# EAGLE design Dreamcast (EAGLE 9.6.2)
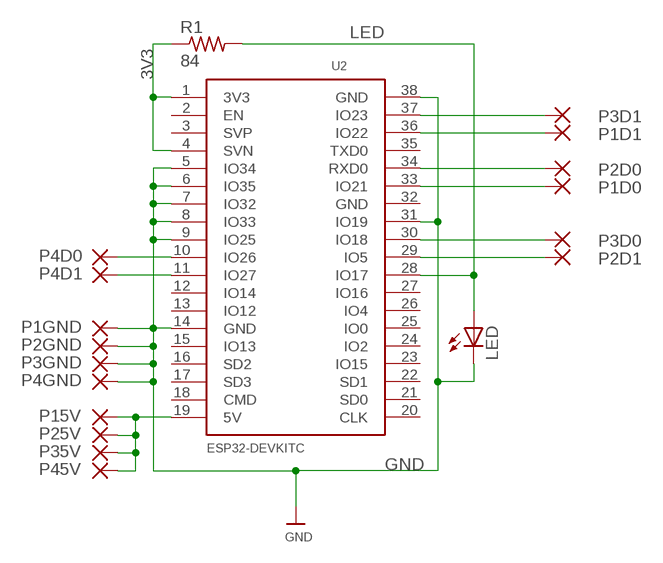
[diagram p0: schematic, sheet 1]

## Parts
LED  LEDCHIPLED_1206  [CHIPLED_1206]
P1D0  SMD5  [SMD2,54-5,08]
P1D1  SMD5  [SMD2,54-5,08]
P1GND  SMD5  [SMD2,54-5,08]
P2D0  SMD5  [SMD2,54-5,08]
P2D1  SMD5  [SMD2,54-5,08]
P2GND  SMD5  [SMD2,54-5,08]
P3D0  SMD5  [SMD2,54-5,08]
P3D1  SMD5  [SMD2,54-5,08]
P3GND  SMD5  [SMD2,54-5,08]
P4D0  SMD5  [SMD2,54-5,08]
P4D1  SMD5  [SMD2,54-5,08]
P4GND  SMD5  [SMD2,54-5,08]
P15V  SMD5  [SMD2,54-5,08]
P25V  SMD5  [SMD2,54-5,08]
P35V  SMD5  [SMD2,54-5,08]
P45V  SMD5  [SMD2,54-5,08]
R1  84  R-US_R1206  [R1206]
U2  ESP32DEVKITC  [ESP32-DEVKITC]

## Nets
3V3: R1.1 U2.1(3V3) U2.4(SVN)
5V: P15V.1(P) P25V.1(P) P35V.1(P) P45V.1(P) U2.19(5V)
GND: LED.C P1GND.1(P) P2GND.1(P) P3GND.1(P) P4GND.1(P) U2.5(IO34) U2.6(IO35) U2.7(IO32) U2.8(IO33) U2.9(IO25) U2.14(GND) U2.31(IO19) U2.38(GND)
LED: LED.A R1.2 U2.28(IO17)
P1D0: P1D0.1(P) U2.33(IO21)
P1D1: P1D1.1(P) U2.36(IO22)
P2D0: P2D0.1(P) U2.34(RXD0)
P2D1: P2D1.1(P) U2.29(IO5)
P3D0: P3D0.1(P) U2.30(IO18)
P3D1: P3D1.1(P) U2.37(IO23)
P4D0: P4D0.1(P) U2.10(IO26)
P4D1: P4D1.1(P) U2.11(IO27)
Unconnected: U2.2(EN) U2.3(SVP) U2.12(IO14) U2.13(IO12) U2.15(IO13) U2.16(SD2) U2.17(SD3) U2.18(CMD) U2.20(CLK) U2.21(SD0) U2.22(SD1) U2.23(IO15) U2.24(IO2) U2.25(IO0) U2.26(IO4) U2.27(IO16) U2.32(GND) U2.35(TXD0)

## Library data of the parts
LED = adafruit:LED: LED OSRAM: - CHIPLED LG R971, LG N971, LY N971, LG Q971, LY Q971, LO R971, LY R971 LH N974, LH R974 LS Q976, LO Q976, LY Q976 LO Q996 - Hyper CHIPLED LW Q18S LB Q993, LB Q99A, LB R99A - SideLED LS A670, LO A670, LY A670, LG A670, LP A670 LB A673, LV A673, LT A673, LW A673 LH A674 LY A675 LS A676, LA A676, LO A676, LY A676, LW A676 LS A679, LY A679, LG A679 - Hyper Micro SIDELED® LS Y876, LA Y876, LO Y876, LY Y876 LT Y87S - SmartLED LW L88C, LW L88S LB L89C, LB L89S, LG L890 LS L89K, LO L89K, LY L89K LS L896, LA L896, LO L896, LY L896 - TOPLED LS T670, LO T670, LY T670, LG T670, LP T670 LSG T670, LSP T670, LSY T670, LOP T670, LYG T670 LG T671, LOG T671, LSG T671 LB T673, LV T673, LT T673, LW T673 LH T674 LS T676, LA T676, LO T676, LY T676, LB T676, LH T676, LSB T676, LW T676 LB T67C, LV T67C, LT T67C, LS T67K, LO T67K, LY T67K, LW E67C LS E67B, LA E67B, LO E67B, LY E67B, LB E67C, LV E67C, LT E67C LW T67C LS T679, LY T679, LG T679 LS T770, LO T770, LY T770, LG T770, LP T770 LB T773, LV T773, LT T773, LW T773 LH T774 LS E675, LA E675, LY E675, LS T675 LS T776, LA T776, LO T776, LY T776, LB T776 LHGB T686 LT T68C, LB T68C - Hyper Mini TOPLED® LB M676 - Mini TOPLED Santana® LG M470 LS M47K, LO M47K, LY M47K Source: http://www.osram.convergy.de/
P1D0 P1D1 P1GND P2D0 P2D1 P2GND P3D0 P3D1 P3GND P4D0 P4D1 P4GND P15V P25V P35V P45V = wirepad:SMD5: SMD PAD
R1 = adafruit:R-US_: RESISTOR, American symbol
U2 = ESP32-DEVKITC4:ESP32DEVKITC

## Board
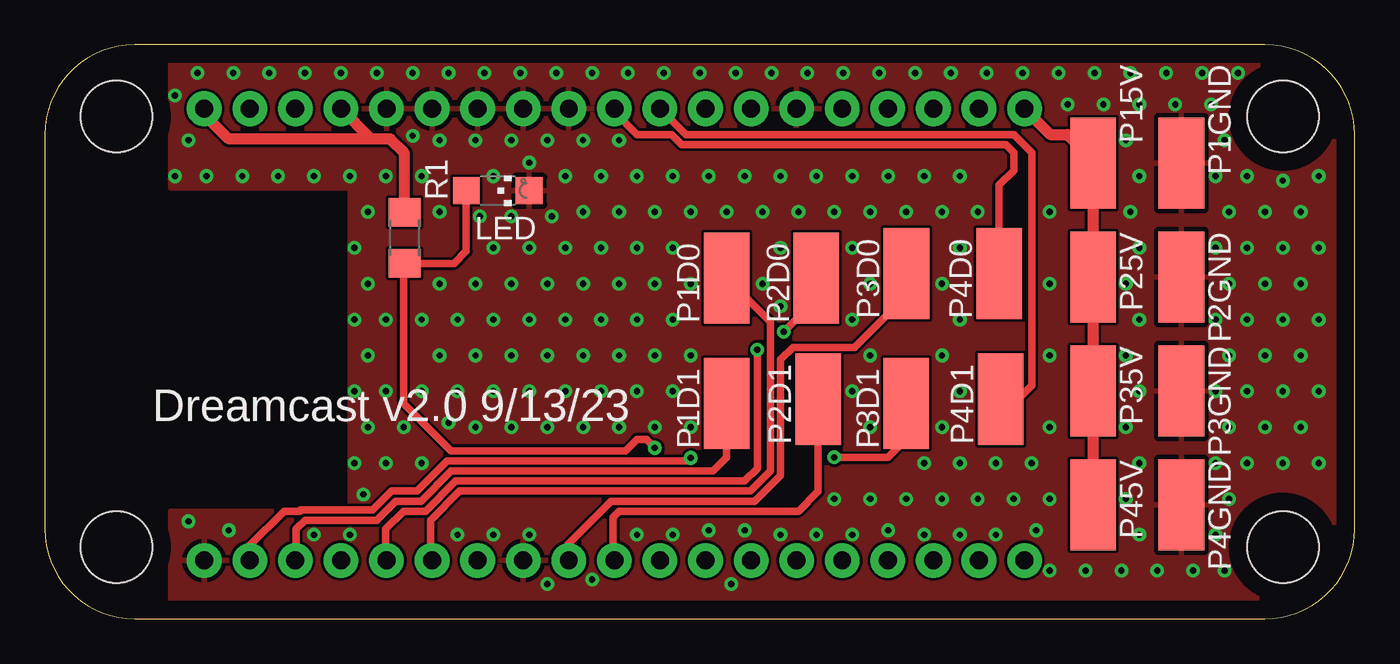
[diagram p1: board, top side]
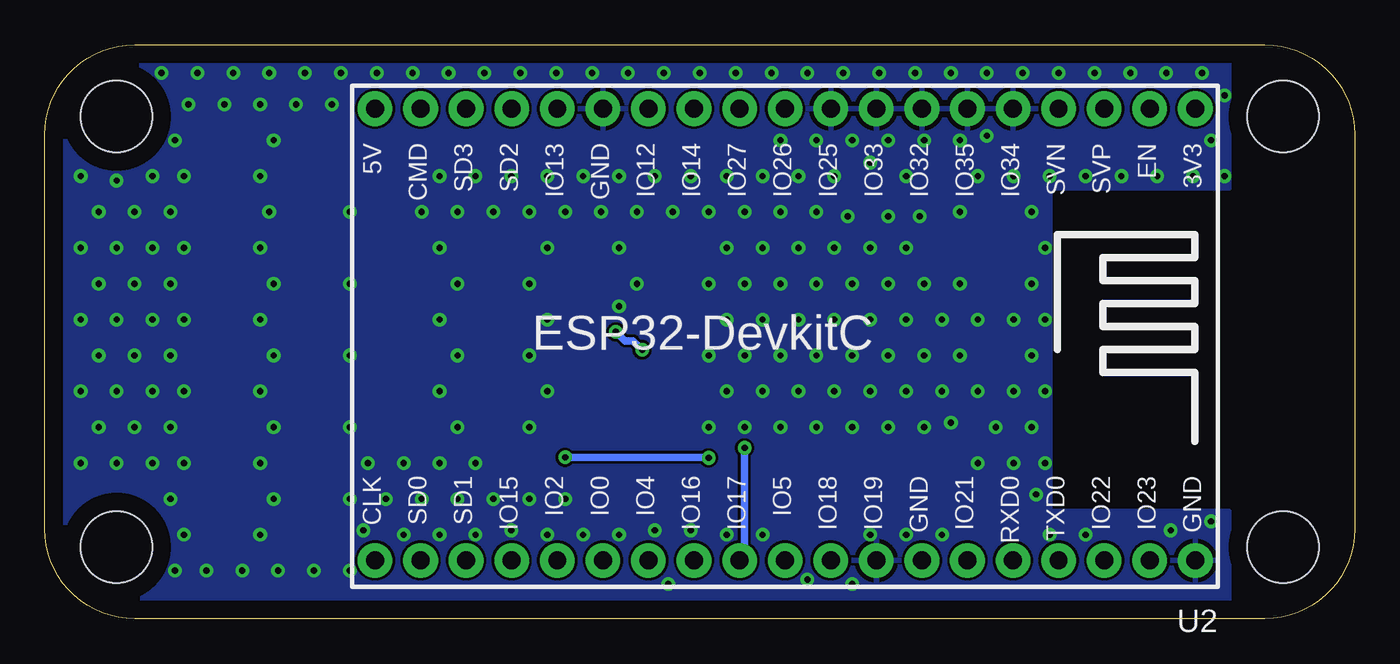
[diagram p2: board, bottom side, seen from below]

Size 73 x 32 mm. Coordinates in mm from the lower left corner, seen from the top.
Outline: 0,27 0,5 arc90 5,0 68,0 arc90 73,5 73,27 arc90 68,32 5,32 arc90 0,27
Copper layers (1*16): Top 0.035mm / dielectric 1.5mm / Bottom 0.035mm
Design rules "default": minimum track width 6mil, minimum drill 0.35mm, track to track 6mil, track to pad 6mil, pad to pad 6mil, via to via 6mil, smd to smd 6mil, copper to edge 40mil, drill to drill 6mil, minimum pad ring 10mil, minimum via ring 8mil, stop-mask expansion 4mil, vias tented up to drill 0.5mm, thermal gap 10mil
Holes 4 mm at 4,4 4,28 69,28 69,4

### Footprints (pad centres in the part's own frame; a part is rotated, then mirrored left to right if it is on the bottom)
CHIPLED_1206 = smd 1.5 x 1.5: A 0,-1.75; C 0,1.75
SMD2,54-5,08 = smd 2.54 x 5.08: 1 0,0
R1206 = smd 1.6 x 1.803: 1 -1.422,0; 2 1.422,0
ESP32-DEVKITC = drill 1 pad 1.93: 1 -22.87,-12.69; 2 -20.33,-12.69; 3 -17.79,-12.69; 4 -15.25,-12.69; 5 -12.71,-12.69; 6 -10.17,-12.69; 7 -7.63,-12.69; 8 -5.09,-12.69; 9 -2.55,-12.69; 10 -0.01,-12.69; 11 2.53,-12.69; 12 5.07,-12.69; 13 7.61,-12.69; 14 10.15,-12.69; 15 12.69,-12.69; 16 15.23,-12.69; 17 17.77,-12.69; 18 20.31,-12.69; 19 22.85,-12.69; 20 22.85,12.5; 21 20.31,12.5; 22 17.77,12.5; 23 15.23,12.5; 24 12.69,12.5; 25 10.15,12.5; 26 7.61,12.5; 27 5.07,12.5; 28 2.53,12.5; 29 -0.01,12.5; 30 -2.55,12.5; 31 -5.09,12.5; 32 -7.63,12.5; 33 -10.17,12.5; 34 -12.71,12.5; 35 -15.25,12.5; 36 -17.79,12.5; 37 -20.33,12.5; 38 -22.87,12.5

### Placement (x,y rotation side)
LED  25.24,23.87 270 top
P1D0  38,19 0 top
P1D1  38,12 0 top
P1GND  63.34,25.4 180 top
P2D0  43,19 0 top
P2D1  43.1,12.24 0 top
P2GND  63.34,19.05 180 top
P3D0  48.02,19.24 0 top
P3D1  48,12 0 top
P3GND  63.34,12.7 180 top
P4D0  53.18,19.24 0 top
P4D1  53.26,12.24 0 top
P4GND  63.34,6.35 180 top
P15V  58.42,25.4 180 top
P25V  58.42,19.05 180 top
P35V  58.42,12.7 180 top
P45V  58.42,6.35 180 top
R1  20.05,21.24 270 top
U2  31.75,15.75 180 bottom

### Tracks (layer width: path | path; a pad name or v marks a point on that pad's centre or on a via)
3V3
  Top 0.61: R1.1 20.05,25.95 19.25,26.75 18.19,26.75 | 18.19,26.75 U2.4 | 18.19,26.75 10.25,26.75 8.88,28.12 U2.1
5V
  Top 0.61: P45V.1 P35V.1 P25V.1 P15V.1 58.42,25.58 57,27 56.04,27 U2.19
GND  (via drill 0.35)
  other vias: 7.25,24.68 7.25,29.18 9,24.68 8,26.68 8.5,30.43 10.25,4.93 11,24.68 10.5,30.43 8,5.43 13,24.68 12.5,30.43 15,4.68 15,24.68 14.5,30.43 17,4.68 17.25,8.68 17.25,12.68 17.25,16.68 17.25,20.68 17,24.68 16.5,30.43 17.75,6.93 19,8.68 18,10.68 19,12.68 18,14.68 19,16.68 18,18.68 18,22.68 19,24.68 18.5,30.43 21,8.68 20,10.68 21,12.68 21,16.68 21,24.68 20.5,26.93 20.5,30.43 23,4.68 22.5,10.93 23,12.68 22,14.68 23,16.68 22,18.68 22,22.68 22,26.68 22.5,30.43 25,4.68 24,10.68 25,12.68 24,14.68 25,16.68 24,18.68 25,20.68 24.25,22.43 25,24.68 24,26.68 24.5,30.43 27,4.68 26,10.68 27,12.68 26,14.68 27,16.68 26,18.68 27,20.68 26,22.43 27,25.43 26,26.68 26.5,30.43 28,1.93 28,10.68 29,12.68 28,14.68 29,16.68 28,18.68 29,20.68 28.25,22.43 29,24.68 28,26.68 28.5,30.43 30.5,2.18 30,10.68 31,12.68 30,14.68 31,16.68 30,18.68 31,20.68 30,22.68 31,24.68 30,26.68 30.5,30.43 33,4.68 32,10.68 33,12.68 32,14.68 33,16.68 32,18.68 33,20.68 32,22.68 33,24.68 32,26.68 32.5,30.43 35,4.68 34,10.68 35,12.68 34,14.68 35,16.68 34,18.68 35,20.68 34,22.68 35,24.68 34.5,30.43 37,4.93 36,10.68 36,14.68 36,18.68 36,22.68 37,24.68 36.5,30.43 38.25,1.93 39,4.93 38,22.68 39,24.68 38.5,30.43 41,4.68 41,17.43 40,18.68 41,20.68 40,22.68 41,24.68 40.5,30.43 43,4.68 42,22.68 43,24.68 42.5,30.43 45,4.68 44,6.68 45,12.68 45,16.68 45,20.68 44,22.68 45,24.68 44.5,30.43 47,4.93 46,6.68 46,10.68 46,14.68 46,18.68 46,22.68 47,24.68 46.5,30.43 49,4.68 48,6.68 49,8.68 48,22.68 49,24.68 48.5,30.43 51,4.68 50,6.68 51,8.68 50,10.68 51,12.68 50,14.68 51,16.68 50,18.68 51,20.68 50,22.68 51,24.68 50.5,30.43 53,4.68 52,6.68 53,8.68 52,22.68 52.5,30.43 55.25,4.93 54,6.68 55,8.68 54.5,30.43 56,2.68 56,6.68 56,10.68 56,14.68 56,18.68 56,22.68 57,28.68 56.5,30.43 58,2.68 59,28.68 58.5,30.43 60,2.68 61,4.68 60.25,6.68 61,8.68 60.25,10.68 61,12.68 60.25,14.68 61,16.68 60.25,18.68 61,20.68 60.5,22.68 61,24.68 60.25,26.68 61,28.68 60.5,30.43 62,2.68 63,28.68 62.5,30.43 64,2.68 65.25,4.68 65.25,8.68 65.25,12.68 65.25,16.68 65.25,20.68 65.25,24.68 65,28.68 64.5,30.43 65.75,2.68 66,6.68 67,8.68 66,10.68 67,12.68 66,14.68 67,16.68 66,18.68 67,20.68 66,22.68 67,24.68 65.75,26.68 66.5,30.43 69,8.68 68,10.68 69,12.68 68,14.68 69,16.68 68,18.68 69,20.68 68,22.68 69,24.43 71,8.68 70,10.68 71,12.68 70,14.68 71,16.68 70,18.68 71,20.68 70,22.68 71,24.68
  pour Top: 7,32 7,24 17,24 17,6 7,6 7,0 73,0 73,32
  pour Bottom: 7,0 73,0 73,32 7,32 7,24 17,24 17,6 7,6
LED  (via drill 0.35)
  Top 0.406: LED.A 23.49,20.49 22.82,19.82 R1.2 20,19.77 20,12 22.65,9.35 32.35,9.35 33,10 33.53,10 v34,9.53
  Bottom 0.406: U2.28 34,3.53 v34,9.53
P1D0
  Top 0.406: P1D0.1 40.44,16.56 40.44,8.23 39.33,7.12 23.12,7.12 21.5,5.5 21.5,3.33 U2.33
P1D1
  Top 0.406: P1D1.1 38,9 37.23,8.23 22.66,8.23 20.98,6.56 19.56,6.56 18.5,5.5 14.5,5.5 14,5 14,4.13 13.96,4.09 U2.36
P2D0  (via drill 0.35)
  Top 0.406: v39.71,15 39.71,8.38 39,7.68 22.89,7.68 21.21,6 20,6 19,5 19,4.05 19.04,4.01 U2.34 | v41.17,16 43,17.82 P2D0.1
  Bottom 0.406: v39.71,15 40.21,15.5 40.67,15.5 v41.17,16
P2D1
  Top 0.406: P2D1.1 43.1,7.1 42,6 32,6 31.66,5.66 31.66,3.33 U2.29
P3D0
  Top 0.406: P3D0.1 48.02,18.02 45.14,15.14 41.68,15.14 41,14.45 41,8 39.56,6.56 31.56,6.56 29.12,4.12 29.12,3.33 U2.30
P3D1  (via drill 0.35)
  Top 0.406: v36,8.97 35.83,8.79 22.42,8.79 20.75,7.12 19.33,7.12 18.27,6.06 14.27,6.06 14.21,6 13.33,6 11.42,4.09 U2.37 | v44,9 47,9 48,10 P3D1.1
  Bottom 0.406: v36,8.97 36.03,9 v44,9
P4D0
  Top 0.406: P4D0.1 53.18,24.18 54,25 54,26 53.56,26.44 35.49,26.44 34.93,27 33,27 31.74,28.26 U2.10
P4D1
  Top 0.406: P4D1.1 54.24,12.24 55,13 55,26 54,27 35.72,27 U2.11

### Text on the board
tNames: Dreamcast v2.0 9/13/23